# Altium schematic sheet 04- Sub Power Supply.SchDoc: Power Supply
size 420 x 297 mm; DocumentNumber: 2; Revision: 1.0; SheetNumber: 4; SheetTotal: 13; Project: LOW LEVEL ECU
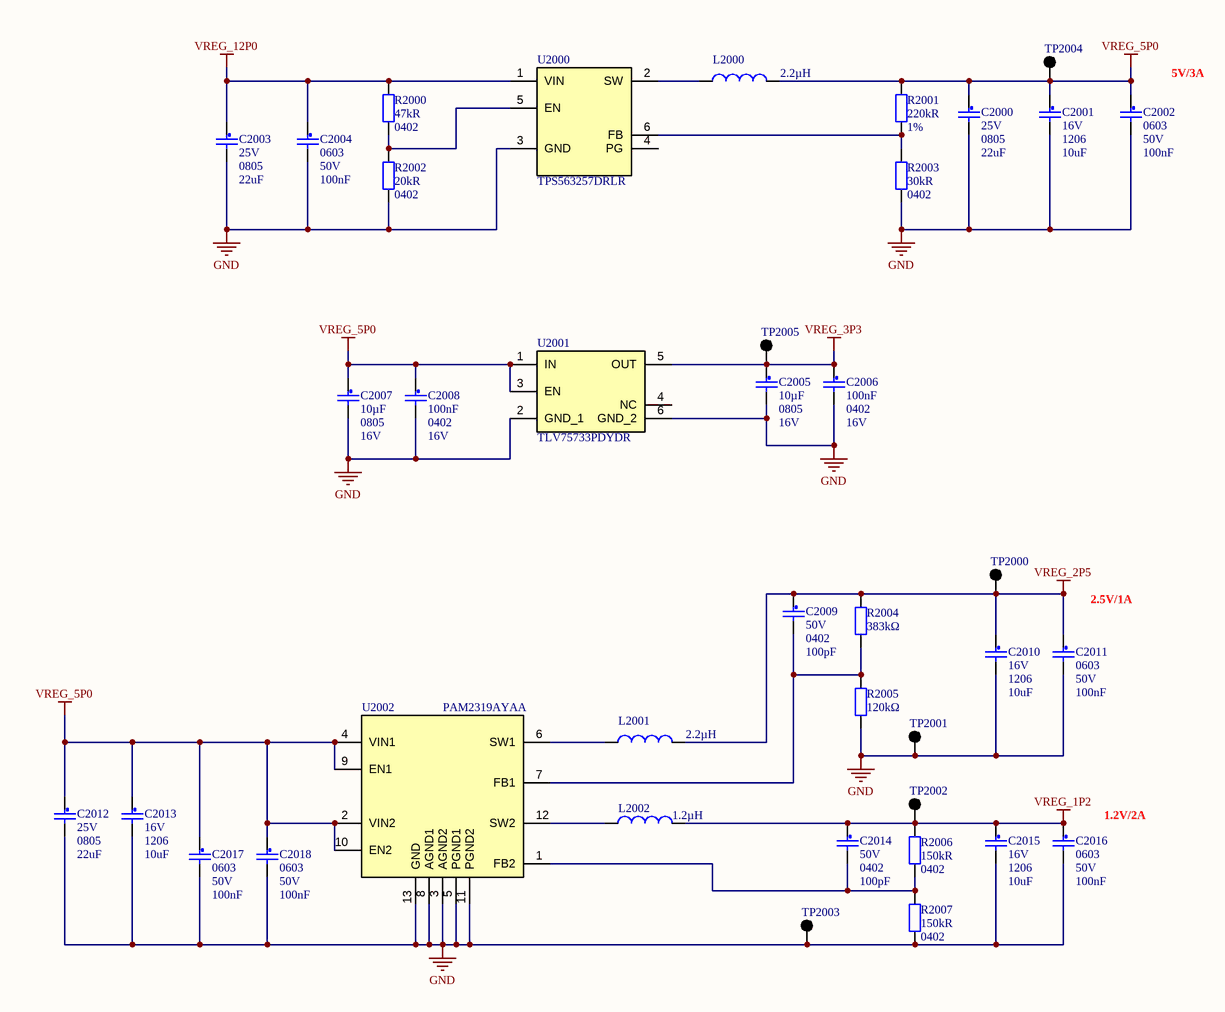
[diagram p0: 04- Sub Power Supply.SchDoc]

## Parts
C2000  Voltage Rating: 25V  Case/Package: 0805  Capacitance: 22uF  [CAP0805]  (hidden comment: GRM21BR61E226ME44K)
C2001  Voltage Rating: 16V  Case/Package: 1206  Capacitance: 10uF  [CAP1206]  (hidden comment: CL31B106KOHVPNE)
C2002  Case/Package: 0603  Voltage Rating: 50V  Capacitance: 100nF  [CAP0603]  (hidden comment: CL10B104KB8WPNC)
C2003  Voltage Rating: 25V  Case/Package: 0805  Capacitance: 22uF  [CAP0805]  (hidden comment: GRM21BR61E226ME44K)
C2004  Case/Package: 0603  Voltage Rating: 50V  Capacitance: 100nF  [CAP0603]  (hidden comment: CL10B104KB8WPNC)
C2005  value 10µF  Case/Package: 0805  Voltage Rating: 16V  [CAP0805]  (hidden comment: GRM21BZ71C106KE15L)
C2006  Capacitance: 100nF  Case/Package: 0402  Voltage Rating (DC): 16V  [CAP0402]  (hidden comment: 0402YC104KAT2A)
C2007  value 10µF  Case/Package: 0805  Voltage Rating: 16V  [CAP0805]  (hidden comment: GRM21BZ71C106KE15L)
C2008  Capacitance: 100nF  Case/Package: 0402  Voltage Rating (DC): 16V  [CAP0402]  (hidden comment: 0402YC104KAT2A)
C2009  Voltage Rating: 50V  Case/Package: 0402  Capacitance: 100pF  [CAP0402]  (hidden comment: GCM1555C1H101JA16D)
C2010  Voltage Rating: 16V  Case/Package: 1206  Capacitance: 10uF  [CAP1206]  (hidden comment: CL31B106KOHVPNE)
C2011  Case/Package: 0603  Voltage Rating: 50V  Capacitance: 100nF  [CAP0603]  (hidden comment: CL10B104KB8WPNC)
C2012  Voltage Rating: 25V  Case/Package: 0805  Capacitance: 22uF  [CAP0805]  (hidden comment: GRM21BR61E226ME44K)
C2013  Voltage Rating: 16V  Case/Package: 1206  Capacitance: 10uF  [CAP1206]  (hidden comment: CL31B106KOHVPNE)
C2014  Voltage Rating: 50V  Case/Package: 0402  Capacitance: 100pF  [CAP0402]  (hidden comment: GCM1555C1H101JA16D)
C2015  Voltage Rating: 16V  Case/Package: 1206  Capacitance: 10uF  [CAP1206]  (hidden comment: CL31B106KOHVPNE)
C2016  Case/Package: 0603  Voltage Rating: 50V  Capacitance: 100nF  [CAP0603]  (hidden comment: CL10B104KB8WPNC)
C2017  Case/Package: 0603  Voltage Rating: 50V  Capacitance: 100nF  [CAP0603]  (hidden comment: CL10B104KB8WPNC)
C2018  Case/Package: 0603  Voltage Rating: 50V  Capacitance: 100nF  [CAP0603]  (hidden comment: CL10B104KB8WPNC)
L2000  value 2.2µH  [INDP414121]  (hidden comment: 74438356022)
L2001  value 2.2µH  [INDP414121]  (hidden comment: 74438356022)
L2002  value 1.2µH  [INDP414121]  (hidden comment: 74438356012)
R2000  Resistance: 47kR  Case/Package: 0402  [RES0402]  (hidden comment: AC0402JR-0747KL)
R2001  value 220kR  Tolerance: 1%  [RES0603]  (hidden comment: RMCF0603FT220K)
R2002  Resistance: 20kR  Case/Package: 0402  [RES0402]  (hidden comment: RC0402FR-0720KL)
R2003  Resistance: 30kR  Case/Package: 0402  [RES0402]  (hidden comment: RMCF0402FT30K0)
R2004  value 383kΩ  [RES0402]  (hidden comment: RC0402FR-07383KL)
R2005  value 120kΩ  [RES0402]  (hidden comment: RT0402FRE07120KL)
R2006  Resistance: 150kR  Case/Package: 0402  [RES0402]  (hidden comment: RC0402FR-07150KL)
R2007  Resistance: 150kR  Case/Package: 0402  [RES0402]  (hidden comment: RC0402FR-07150KL)
TP2000  TP  [TP-SMD-R1]  (value not drawn)  (no BOM)
TP2001  TP  [TP-SMD-R1]  (value not drawn)  (no BOM)
TP2002  TP  [TP-SMD-R1]  (value not drawn)  (no BOM)
TP2003  TP  [TP-SMD-R1]  (value not drawn)  (no BOM)
TP2004  TP  [TP-SMD-R1]  (value not drawn)  (no BOM)
TP2005  TP  [TP-SMD-R1]  (value not drawn)  (no BOM)
U2000  TPS563257DRLR  [SOT-563]
U2001  TLV75733PDYDR  [SOT-23-5 with EPAD]
U2002  PAM2319AYAA  [12-WFDFN_Exposed Pad]

## Nets
GND: C2000.2 C2001.2 C2002.2 C2003.2 C2004.2 C2005.2 C2006.2 C2007.2 C2008.2 C2010.2 C2011.2 C2012.2 C2013.2 C2015.2 C2016.2 C2017.2 C2018.2 R2002.1 R2003.1 R2005.1 R2007.1 TP2001.1 TP2003.1 U2000.3(GND) U2001.2(GND_1) U2001.6(GND_2) U2002.3(AGND2) U2002.5(PGND1) U2002.8(AGND1) U2002.11(PGND2) U2002.13(GND)
VREG_1P2: C2014.1 C2015.1 C2016.1 L2002.2 R2006.2 TP2002.1
VREG_2P5: C2009.1 C2010.1 C2011.1 L2001.2 R2004.2 TP2000.1
VREG_3P3: C2005.1 C2006.1 TP2005.1 U2001.5(OUT)
VREG_5P0: C2000.1 C2001.1 C2002.1 C2007.1 C2008.1 C2012.1 C2013.1 C2017.1 C2018.1 L2000.2 R2001.1 TP2004.1 U2001.1(IN) U2001.3(EN) U2002.2(VIN2) U2002.4(VIN1) U2002.9(EN1) U2002.10(EN2)
VREG_12P0: C2003.1 C2004.1 R2000.2 U2000.1(VIN)
NetC2009_2: C2009.2 R2004.1 R2005.2 U2002.7(FB1)
NetC2014_2: C2014.2 R2006.1 R2007.2 U2002.1(FB2)
NetL2000_1: L2000.1 U2000.2(SW)
NetL2001_1: L2001.1 U2002.6(SW1)
NetL2002_1: L2002.1 U2002.12(SW2)
NetR2000_1: R2000.1 R2002.2 U2000.5(EN)
NetR2001_2: R2001.2 R2003.2 U2000.6(FB)

Not connected (* = marked no-connect by the designer): U2000 4(PG); U2001 4(NC)

## Notes on the sheet
- (near C2002) 5V/3A
- (near C2011) 2.5V/1A
- (near C2016) 1.2V/2A
- TITLE:
- PROJECT:
- Design by:
- Check by:
- Approve by:
- DRAWING NUMBER:
- REVISION:
- SIZE: A3
- SHEET NUMBER
- OFF
- DATE:

## Library data of the parts
C2000 C2003 C2012 = CMP-ROOT-0068-6: CAP CER 22uF 25V 20% X5R 0805 SMD; Manufacturer 1: Murata Electronics; Crossable(YES/NO): YES; Height: 1.25mm; Length: 0.079inch; Max Operating Temperature: 85°C; Tolerance: 20%; Mount Type(SMD/TH): SMD; Manufacturer Part Number 1: GRM21BR61E226ME44K; Weight: 0.000335oz; Dielectric: X5R; Packaging: Tape and Reel; Package Quantity: 10000; Mount: Surface Mount; Termination: SMD/SMT; Composition: Ceramic; Case Code (Imperial): 0805; Thickness: 0.057inch; Voltage Rating (DC): 25V; Case Code (Metric): 2012; Width: 1.25mm; Min Operating Temperature: -55°C; Lead Free: Lead Free
C2001 C2010 C2013 C2015 = CMP-00045-5: CAP CER 10uF 16V 10% X7R 1206 SMD; Manufacturer 1: Samsung; Crossable(YES/NO): YES; Ratings: AEC-Q200; Packaging: Tape and Reel; Thickness: 0.071inch; Min Operating Temperature: -55°C; Case Code (Metric): 3216; Max Operating Temperature: 125°C; Mount: Surface Mount; Length: 0.126inch; Dielectric: X7R; Tolerance: 10%; Width: 0.063inch; Case Code (Imperial): 1206; Manufacturer Part Number 1: CL31B106KOHVPNE; Features: Soft Termination; Mount Type(SMD/TH): SMD; Height: 1.6mm; Lead Free: Lead Free; Voltage Rating (DC): 16V
C2002 C2004 C2011 C2016-C2018 = CMP-00005-5: CAP CER 0.1UF 50V X7R 0603; Manufacturer 1: Samsung; Mount Type(SMD/TH): SMD; Crossable(YES/NO): YES; Tolerance: 10%; Length: 0.063inch; Mount: Surface Mount; Thickness: 0.035inch; Max Operating Temperature: 125°C; Lead Free: Lead Free; Ratings: AEC-Q200; Min Operating Temperature: -55°C; Case Code (Metric): 1608; Features: Soft Termination; Case Code (Imperial): 0603; Width: 0.031inch; Manufacturer Part Number 1: CL10B104KB8WPNC; Packaging: Tape and Reel; Height: 0.8mm; Voltage Rating (DC): 50V
C2005 C2007 = CMP-01170-1: CAP CER 10UF 16V X7R 0805; Manufacturer: Murata; Manufacturer Lifecycle Status: IN PRODUCTION; Dielectric Material: Ceramic; Tolerance: 10%; Length: 2mm; Category: Ceramic Capacitors; Height: 1.25mm; Lifecycle Status: Production; Manufacturer Part Number: GRM21BZ71C106KE15L; Material: Ceramic; Max Operating Temperature: 125°C; Min Operating Temperature: -55°C; Mounting Technology: Surface Mount; Number of Terminals: 2; REACH SVHC: Yes; RoHS: Compliant; Thickness: 1.25mm; Voltage Rating (DC): 16V; Width: 1.25mm
C2006 C2008 = CMP-00988-1: CAP CER 0.1UF 16V X7R 0402; Manufacturer 1: KYOCERA AVX; Crossable(YES/NO): YES; Mount Type(SMD/TH): SMD; Case Code (Imperial): 0402; Case Code (Metric): 1005; Dielectric: X7R; Manufacturer Part Number 1: 0402YC104KAT2A; Max Operating Temperature: 125°C; Min Operating Temperature: -55°C; Mount: Surface Mount; Voltage Rating: 16V
C2009 C2014 = CMP-00107-4: CAP CER 100pF 50V 5% C0G 0402 SMD; Manufacturer 1: Murata Electronics; Crossable(YES/NO): YES; Depth: 0.5mm; Thickness: 0.022inch; Voltage: 50V; Max Operating Temperature: 125°C; Dielectric: C0G; Radiation Hardening: No; Case Code (Metric): 1005; Weight: 0.000212oz; Manufacturer Part Number 1: GCM1555C1H101JA16D; Package Quantity: 10000; Termination: SMD/SMT; Tolerance: 5%; Voltage Rating (DC): 50V; Mount: Surface Mount; Min Operating Temperature: -55°C; Mount Type(SMD/TH): SMD; Height: 0.5mm; Case Code (Imperial): 0402; Width: 0.02inch; Packaging: Tape and Reel; Lead Free: Lead Free; REACH SVHC: No SVHC; Length: 1mm; Ratings: AEC-Q200
L2000 L2001 = CMP-01184-1: FIXED IND 2.2UH 4.7A 35 MOHM SMD; Manufacturer: Wurth Elektronik; Core Material: Composite, Metal; DC Resistance (DCR): 29mΩ; Inductance Tolerance: 20%; Saturation Current: 6.2A; Self Resonant Frequency: 34MHz; Shielding: Shielded; Test Frequency: 100kHz; Case/Package: SMD/SMT; Ambient Temperature Range High: 85°C; Ambient Temperature Range Low: -40°C; Category: Fixed Inductors; Current Rating: 4.7A; Height: 2mm; Height - Seated (Max): 2.1082mm; Length: 4mm; Manufacturer Part Number: 74438356022; Max Operating Temperature: 125°C; Min Operating Temperature: -40°C; Mounting Technology: Surface Mount; Pins: 2; REACH SVHC: Unknown; RMS Current (Irms): 4.7A; RoHS: Compliant; Tolerance: 20%; Width: 4mm
L2002 = CMP-01185-1: FIXED IND 1.2UH 5.8A 18 MOHM SMD; Manufacturer: Wurth Elektronik; Core Material: Composite, Metal; DC Resistance (DCR): 15mΩ; Inductance Tolerance: 20%; Saturation Current: 9A; Self Resonant Frequency: 52MHz; ESR: 18mΩ; Shielding: Shielded; Test Frequency: 100kHz; Ambient Temperature Range High: 85°C; Ambient Temperature Range Low: -40°C; Case/Package: SMD/SMT; Category: Fixed Inductors; Current Rating: 5.8A; Height: 2mm; Height - Seated (Max): 2.1082mm; Length: 4mm; Manufacturer Part Number: 74438356012; Max Operating Temperature: 125°C; Min Operating Temperature: -40°C; Mounting Technology: Surface Mount; Pins: 2; REACH SVHC: Unknown; RMS Current (Irms): 5.8A; RoHS: Compliant; Tolerance: 20%; Width: 4mm
R2000 = CMP-00109-2: RES SMD 47K OHM 5% 1/16W 0402; Manufacturer 1: Yageo; Power Rating: 62.5mW; Voltage Rating: 50V; Max Power Dissipation: 63mW; Temperature Coefficient: 100ppm/°C; Crossable(YES/NO): YES; Height: 0.015inch; Mount Type(SMD/TH): SMD; Features: Moisture Resistant,Automotive AEC-Q200; Min Operating Temperature: -55°C; Number of Terminations: 2; Case Code (Metric): 1005; Packaging: Tape and Reel; Width: 0.02inch; Manufacturer Part Number 1: AC0402JR-0747KL; Tolerance: 5%; Termination: SMD/SMT; Lead Free: Lead Free; Case Code (Imperial): 0402; Length: 0.039inch; Composition: Thick Film; Max Operating Temperature: 155°C
R2001 = CMP-01087-1: RES 220K OHM 1% 1/10W 0603; Manufacturer: Stackpole Electronics; Package Width: 0.8mm; Package Height: 0.45mm; Package Length: 1.55mm; Power: 100mW; Rated Temperature: 70°C; Reference Standard: AEC-Q200; Temperature Coefficient (ppm/Cel): 100; Working Voltage: 75V; Category: Chip SMD Resistors; Construction: Rectangular; JESD-609 Code: e3; Manufacturer Part Number: RMCF0603FT220K; Max Operating Temperature: 155°C; Min Operating Temperature: -55°C; Mounting Technology: Surface Mount; Pins: 2; Package Shape: Rectangular; Packaging: Tape and Reel; Reach SVHC Compliant: Yes; Resistor Type: FIXED RESISTOR; RoHS Compliant: Yes; Case/Package: 0603; Technology: METAL GLAZE/THICK FILM; Terminal Finish: Nickel; Termination: Wraparound
R2002 = CMP-00464-1: RES SMD 20K OHM 1% 1/16W 0402; Manufacturer 1: Yageo; Power Rating: 62.5mW; Crossable(YES/NO): YES; Max Power Dissipation: 63mW; Temperature Coefficient: 100ppm/°C; Voltage Rating: 50V; REACH SVHC: No SVHC; Length: 1mm; Termination: SMD/SMT; Mount Type(SMD/TH): SMD; Number of Pins: 2; Lead Free: Lead Free; Number of Terminations: 2; Width: 0.02inch; Composition: Thick Film; Manufacturer Part Number 1: RC0402FR-0720KL; Features: Moisture Resistant; Min Operating Temperature: -55°C; Max Operating Temperature: 155°C; Packaging: Tape and Reel; Depth: 0.5mm; Case Code (Imperial): 0402; Height: 0.016inch; Voltage Rating (DC): 50V; Case Code (Metric): 1005; Military Standard: Not; Package Quantity: 1; Tolerance: 1%
R2003 = CMP-00355-2: RES 30kR 1/16W 1% 0402 SMD; Manufacturer 1: Stackpole Electronics Inc; Max Power Dissipation: 63mW; Crossable(YES/NO): YES; Temperature Coefficient: 100ppm/°C; Case Code (Metric): 1005; Case Code (Imperial): 0402; Tolerance: 1%; Contact Plating: Tin,Matte; Features: Automotive AEC-Q200; Number of Terminations: 2; Length: 0.039inch; Packaging: Tape and Reel; Max Operating Temperature: 155°C; Mount Type(SMD/TH): SMD; Min Operating Temperature: -55°C; Mount: Surface Mount; Height: 0.016inch; Radiation Hardening: No; Composition: Thick Film; Manufacturer Part Number 1: RMCF0402FT30K0; Width: 0.02inch; Package Quantity: 10000
R2004 = CMP-01187-1: RES 383K OHM 1% 1/16W 0402; Manufacturer: Yageo Group; Max Power Dissipation: 63mW; Power Dissipation: 62.5mW; Temperature Coefficient: 100ppm/°C; Voltage Rating: 50V; China RoHS: Non-Compliant; Case Code (Imperial): 0402; Case Code (Metric): 1005; Case/Package: 0402; Category: Chip SMD Resistors; Composition: Thick Film; Contact Plating: Tin; Depth: 500µm; Features: Moisture Resistant; Height: 350µm; Lead Free: Lead Free; Length: 1mm; Lifecycle Status: Production; Manufacturer Part Number: RC0402FR-07383KL; Max Operating Temperature: 155°C; Military Standard: Not; Min Operating Temperature: -55°C; Mounting Technology: Surface Mount; Number of Terminals: 2; Number of Terminations: 2; Power Rating: 63mW; Radiation Hardening: No; REACH SVHC: Yes; RoHS: Compliant; Schedule B: 8533210045, 8533210045|8533210045|8533210045|8533210045|8533210045; Termination: SMD/SMT; Tolerance: 1%; Voltage Rating (DC): 50V; Width: 500µm; Working Voltage: 50V
R2005 = CMP-01186-1: RES SMD 120K OHM 1% 1/16W 0402; Manufacturer: Yageo Group; Power Dissipation: 62.5mW; Power Rating: 63mW; Temperature Coefficient: 50ppm/°C; Voltage Rating: 50V; China RoHS: Non-Compliant; Case Code (Metric): 0402; Case/Package: 0402; Category: Chip SMD Resistors; Composition: Thin Film; Contact Plating: Tin; Depth: 500µm; Height: 300µm; Lead Free: Lead Free; Length: 1mm; Lifecycle Status: Production; Manufacturer Part Number: RT0402FRE07120KL; Max Operating Temperature: 155°C; Military Standard: Not; Min Operating Temperature: -55°C; Mounting Technology: Surface Mount; Number of Terminals: 2; Radiation Hardening: No; REACH SVHC: Yes; RoHS: Compliant; Tolerance: 1%; Voltage Rating (DC): 50V; Width: 500µm; Working Voltage: 50V
R2006 R2007 = CMP-00368-1: RES SMD 150K OHM 1% 1/16W 0402; Manufacturer 1: Yageo; Voltage Rating (DC): 50V; Power Rating: 62.5mW; Crossable(YES/NO): YES; Temperature Coefficient: 100ppm/°C; Max Power Dissipation: 63mW; Tolerance: 1%; Termination: SMD/SMT; Number of Pins: 2; Features: Moisture Resistant; Min Operating Temperature: -55°C; REACH SVHC: No SVHC; Military Standard: Not; Packaging: Tape and Reel; Composition: Thick Film; Mount Type(SMD/TH): SMD; Package Quantity: 1; Height: 0.016inch; Case Code (Imperial): 0402; Manufacturer Part Number 1: RC0402FR-07150KL; Depth: 0.5mm; Lead Free: Lead Free; Case Code (Metric): 1005; Width: 0.5mm; Voltage Rating: 50V; Working Voltage: 50V; Length: 1mm; Max Operating Temperature: 155°C; Number of Terminations: 2
TP2000-TP2005 = CMP-ROOT-0080-12: Test Point 1x1mm; Manufacturer Part Number 1: NA; Mount Type(SMD/TH): TH; Crossable(YES/NO): YES; Manufacturer 1: N/A
U2000 = CMP-01183-1: IC REG BUCK ADJ 3A SOT563; Manufacturer: Texas Instruments; Manufacturer Lifecycle Status: ACTIVE; Category: Voltage Regulators - Switching; Height: 600µm; Length: 1.6mm; Lifecycle Status: Production; Manufacturer Part Number: TPS563257DRLR; Pins: 6; RoHS: Compliant; Thickness: 550µm; Topology: Buck; Width: 1.2mm
U2001 = CMP-01189-1: IC REG LINEAR 3.3V 1A SOT23-5; Manufacturer: Texas Instruments; Manufacturer Lifecycle Status: ACTIVE; Dropout Voltage: 1.35V; Accuracy: 1%; Max Junction Temperature (Tj): 125°C; Max Supply Voltage: 5.5V; Min Supply Voltage: 1.45V; Number of Outputs: 1; Case/Package: SOT-23; Category: LDO Voltage Regulators; Height: 1.45mm; Length: 2.9mm; Lifecycle Status: Production; Manufacturer Part Number: TLV75733PDYDR; Max Operating Temperature: 125°C; Min Operating Temperature: -40°C; Pins: 5; Output Current: 1A; Output Voltage: 3.3V; RoHS: Compliant; Schedule B: 8542390000, 8542390000|8542390000|8542390000|8542390000|8542390000; Thickness: 1.2mm; Width: 1.6mm
U2002 = CMP-01159-1: IC REG BUCK ADJ 1A/2A DL 12WDFN; Manufacturer: Diodes Inc.; Efficiency: 87%; Max Supply Voltage: 5.5V; Max Output current: 2A; Max Output Voltage: 3.3V; Min Input Voltage: 2.7V; Min Output Voltage: 1V; Number of Outputs: 2; Output Configuration: Positive; Output Type: Adjustable; Switching Frequency: 2.5MHz; Synchronous Rectifier: Yes; Category: Voltage Regulators - Switching; China RoHS: Compliant; Color: Black; Diameter: 20.193mm; Height: 14.986mm; Lead Free: Lead Free; Lifecycle Status: Production; Manufacturer Part Number: PAM2319AYAA; Material: Plastic; Max Operating Temperature: 85°C; Min Operating Temperature: -40°C; Mounting Technology: Surface Mount; Pins: 12; Operating Supply Voltage: 5.5V; Output Current: 2A; Output Voltage: 3.3V; Packaging: Tape & Reel; Radiation Hardening: No; REACH SVHC: Yes; RoHS: Compliant; Schedule B: 8542390000, 8542390000|8542390000|8542390000|8542390000|8542390000